# Altium schematic sheet MPC23017.SchDoc
size A
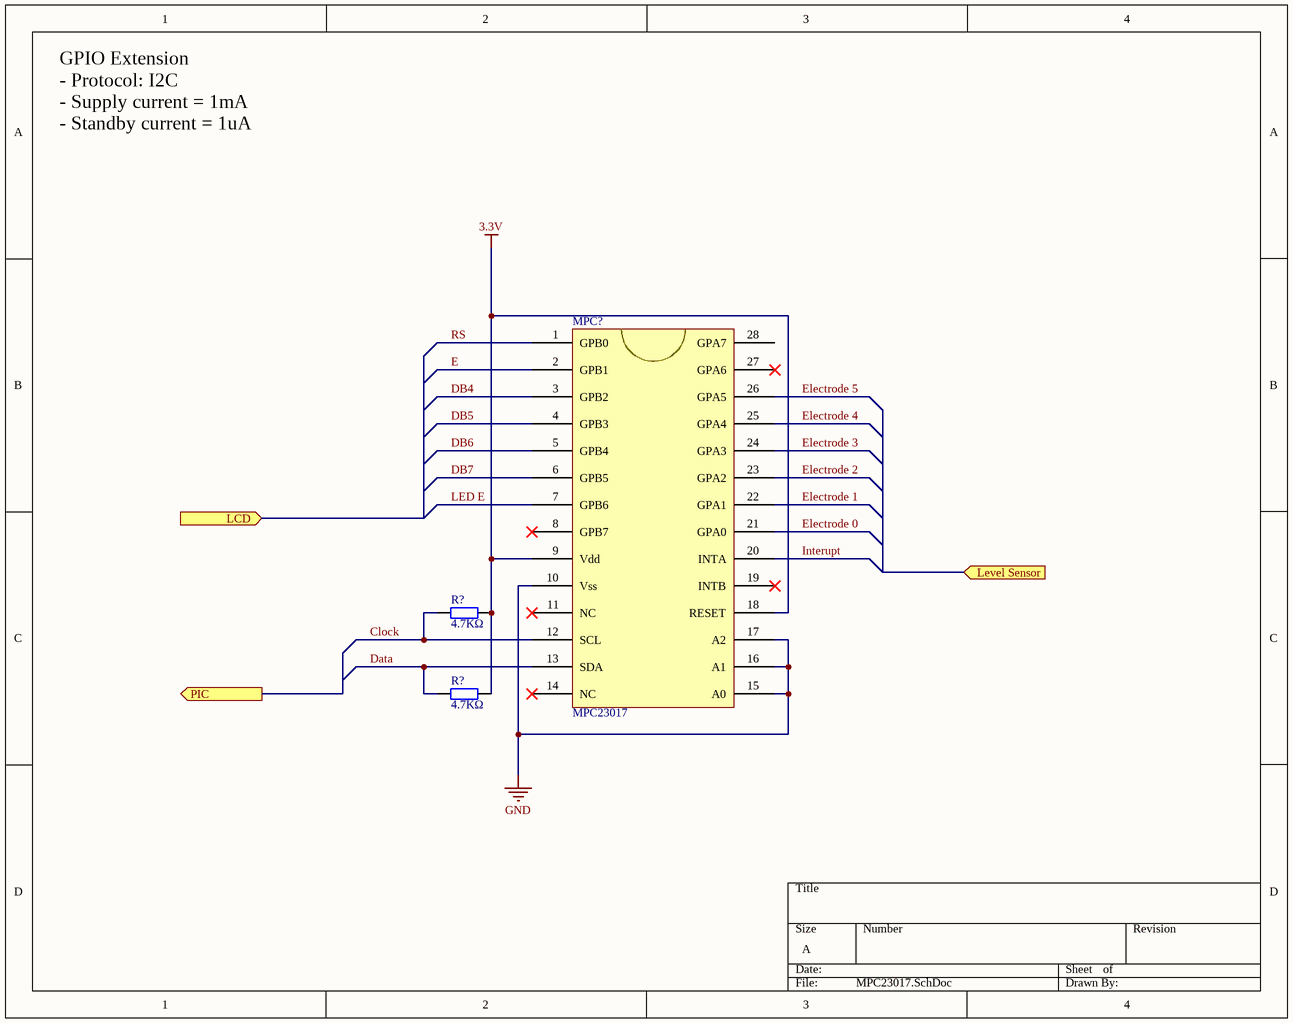
[diagram p0: MPC23017.SchDoc]

## Parts
(Parts that share a designator on the sheet are numbered #1, #2 ... from top to bottom, then left to right.)
MPC?  MPC23017
R?#1  4.7KΩ  [AXIAL-0.4]
R?#2  4.7KΩ  [AXIAL-0.4]

## Ports
LCD (in), Level Sensor (in), PIC (out)

## Nets
3.3V: MPC?.9(Vdd) MPC?.18(RESET) R?#1.1 R?#2.1
GND: MPC?.10(Vss) MPC?.15(A0) MPC?.16(A1) MPC?.17(A2)
Clock: MPC?.12(SCL) R?#1.2
Data: MPC?.13(SDA) R?#2.2
DB4: MPC?.3(GPB2)
DB5: MPC?.4(GPB3)
DB6: MPC?.5(GPB4)
DB7: MPC?.6(GPB5)
E: MPC?.2(GPB1)
Electrode 0: MPC?.21(GPA0)
Electrode 1: MPC?.22(GPA1)
Electrode 2: MPC?.23(GPA2)
Electrode 3: MPC?.24(GPA3)
Electrode 4: MPC?.25(GPA4)
Electrode 5: MPC?.26(GPA5)
Interupt: MPC?.20(INTA)
LED E: MPC?.7(GPB6)
RS: MPC?.1(GPB0)

Not connected (* = marked no-connect by the designer): MPC? 8(GPB7)* 11(NC)* 14(NC)* 19(INTB)* 27(GPA6)* 28(GPA7)

## Notes on the sheet
- GPIO Extension
  - Protocol: I2C
  - Supply current = 1mA
  - Standby current = 1uA

## Library data of the parts
MPC? = Component_1
R?#1 R?#2 = Res2: Resistor; Value: 1K; Published: 8-Jun-2000; LatestRevisionDate: 17-Jul-2002; LatestRevisionNote: Re-released for DXP Platform.; PackageReference: AXIAL-0.4; Publisher: Altium Limited; PackageDescription: Axial Device, Thru-Hole; 2 Leads; 0.4 in Pin Spacing